# EAGLE design urbansensor (EAGLE 9.6.2)
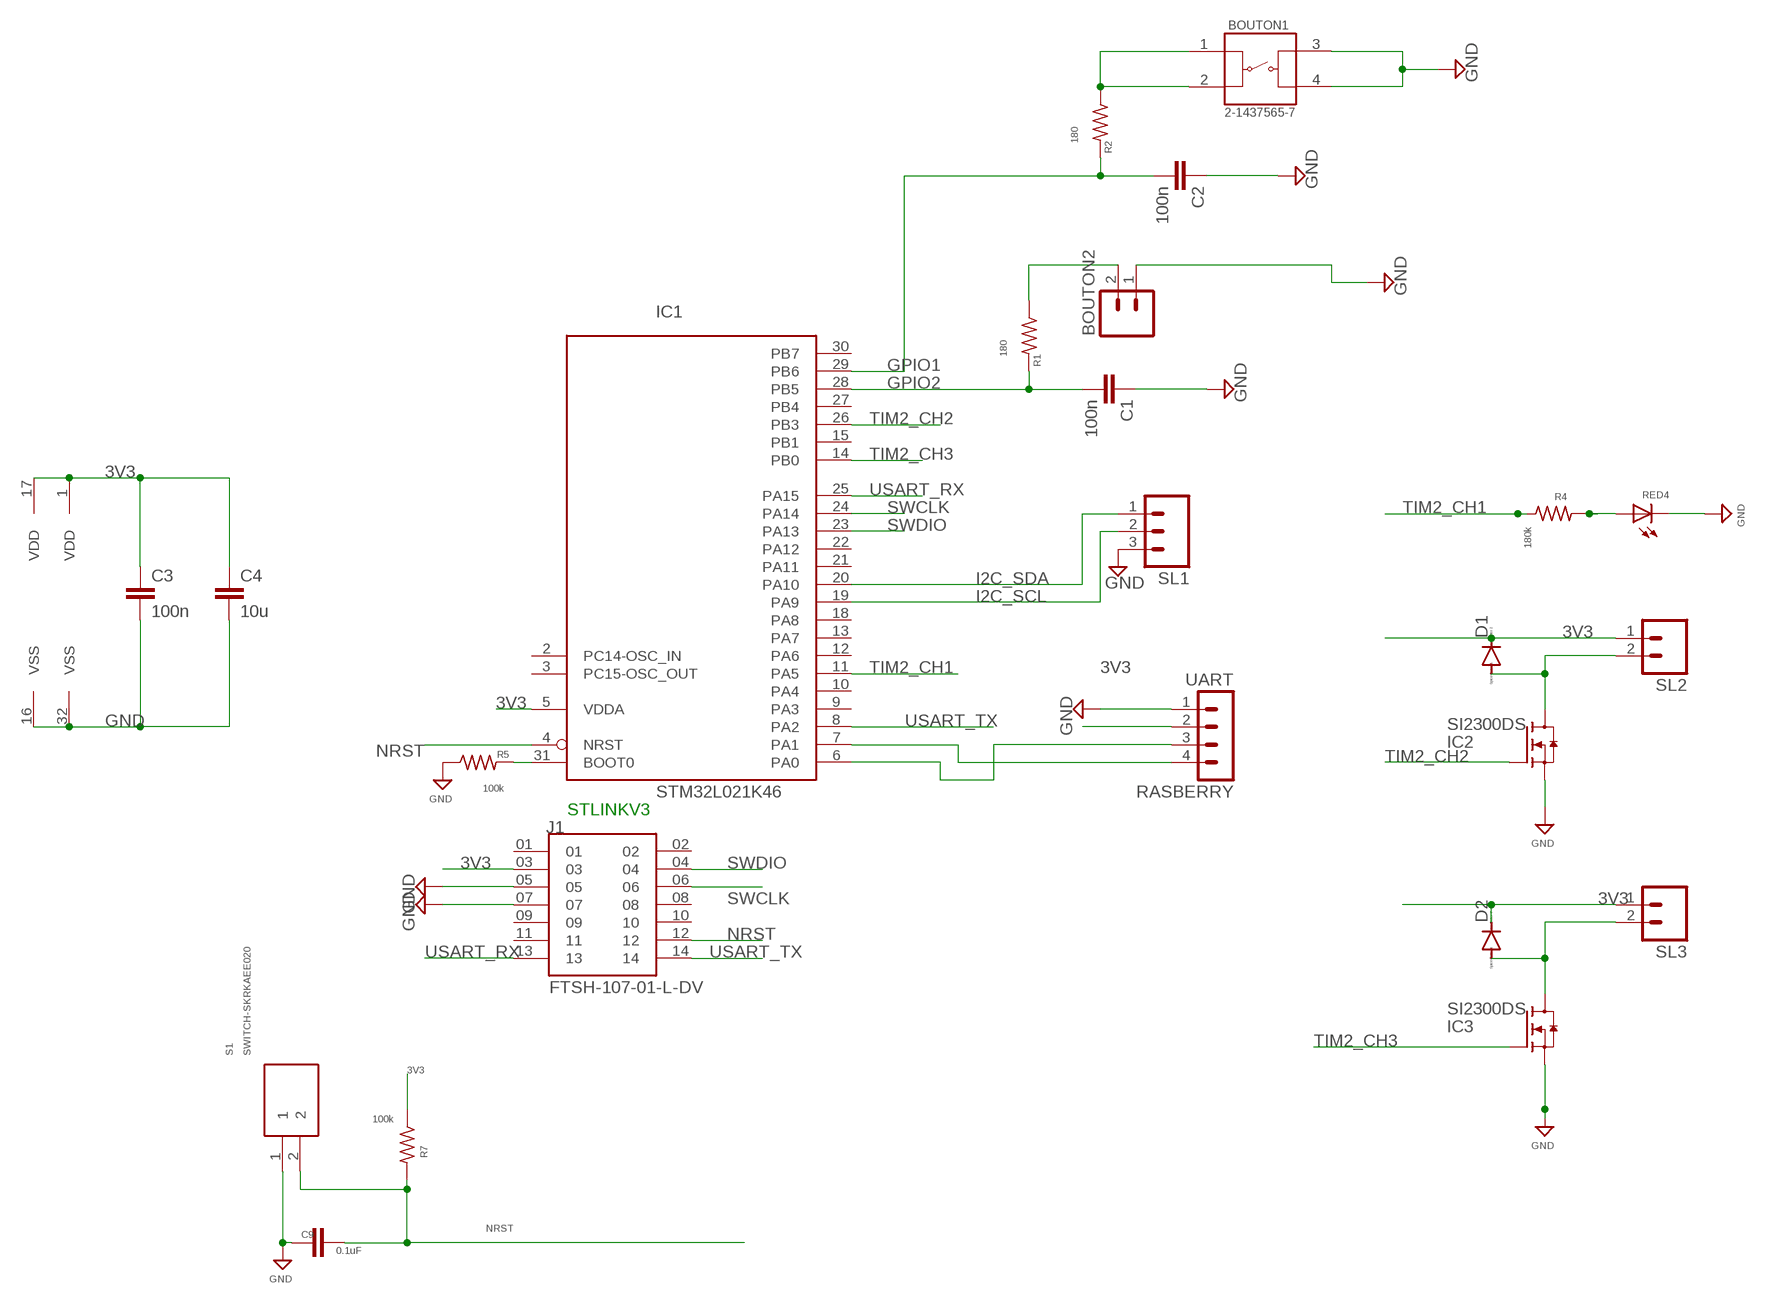
[diagram p0: schematic, sheet 1]

## Parts
BOUTON1  2-1437565-7  [SW_2-1437565-7]
BOUTON2  MA02  [02PA]
C1  100n  C-EUC0805  [C0805]
C2  100n  C-EUC0805  [C0805]
C3  100n  C-EUC0805  [C0805]
C4  10u  C-EUC1210  [C1210]
C9  0.1uF  PASSIF-CAP-1206  [1206]
D1  DIODE-SOD523  [SOD523]
D2  DIODE-SOD523  [SOD523]
IC1  STM32L021K46  [LQFP32]
IC2  SI2300DS  [SOT23]
IC3  SI2300DS  [SOT23]
J1  FTSH-107-01-L-DV  [SAMTEC_FTSH-107-01-L-DV]
R1  180  R-US0805  [R0805]
R2  180  R-US0805  [R0805]
R4  180k  R-US0805  [R0805]
R5  100k  R-US0805  [R0805]
R7  100k  R-US0805  [R0805]
RASBERRY  UART  MA04-1  [MA04-1]
RED4  LED-0603  [0603-LED]
S1  SWITCH-SKRKAEE020  [SKRKAEE020]
SL1  MA03  [03P]
SL2  MA02  [02PA]
SL3  MA02  [02PA]

## Nets
3V3: C3.1 C4.1 D1.C D2.C IC1.1(VDD) IC1.5(VDDA) IC1.17(VDD) J1.03 R7.1 RASBERRY.2 SL2.1 SL3.1
GND: BOUTON1.3 BOUTON1.4 BOUTON2.1 C1.1 C2.1 C3.2 C4.2 C9.1 IC1.16(VSS) IC1.32(VSS) IC2.2(S) IC3.2(S) J1.05 J1.07 R5.1 RASBERRY.1 RED4.C S1.1 SL1.3
GPIO1: C2.2 IC1.29(PB6) R2.2
GPIO2: C1.2 IC1.28(PB5) R1.2
I2C_SCL: IC1.19(PA9) SL1.2
I2C_SDA: IC1.20(PA10) SL1.1
LED_RD4: R4.2 RED4.A
N$1: IC1.7(PA1) RASBERRY.4
N$2: BOUTON2.2 R1.1
N$3: BOUTON1.1 BOUTON1.2 R2.1
N$4: D1.A IC2.3(D) SL2.2
N$5: IC1.31(BOOT0) R5.2
N$6: D2.A IC3.3(D) SL3.2
N$7: IC1.6(PA0) RASBERRY.3
NRST: C9.2 IC1.4(NRST) J1.12 R7.2 S1.2
SWCLK: IC1.24(PA14) J1.06
SWDIO: IC1.23(PA13) J1.04
TIM2_CH1: IC1.11(PA5) R4.1
TIM2_CH2: IC1.26(PB3) IC2.1(G)
TIM2_CH3: IC1.14(PB0) IC3.1(G)
USART_RX: IC1.25(PA15) J1.13
USART_TX: IC1.8(PA2) J1.14
Unconnected: IC1.2(PC14-OSC_IN) IC1.3(PC15-OSC_OUT) IC1.9(PA3) IC1.10(PA4) IC1.12(PA6) IC1.13(PA7) IC1.15(PB1) IC1.18(PA8) IC1.21(PA11) IC1.22(PA12) IC1.27(PB4) IC1.30(PB7) J1.01 J1.02 J1.08 J1.09 J1.10 J1.11

## Notes on the sheet
- STLINKV3

## Library data of the parts
BOUTON1 = 2-1437565-7:2-1437565-7: FSM2JSMA=SMT,TACTILE,PB SWITCH Check availability <https://pricing.snapeda.com/parts/FSM2JSMA/TE%20Connectivity/view-part?ref=eda>; AVAILABILITY: In Stock; COMMENT: 2-1437565-7; CONFIGURATION_POLE-THROW: Single Pole - Single Throw; CONTACT_CURRENT_RATING: 50 mA; DESCRIPTION: Tactile Switch SPST-NO Top Actuated Surface Mount; MF: TE Connectivity; MP: FSM2JSMA; PACKAGE: None; PRICE: None; PURCHASE-URL: https://pricing.snapeda.com/search/part/FSM2JSMA/?ref=eda
BOUTON2 SL2 SL3 = con-amp-quick:MA02: AMP QUICK CONNECTOR; OC_FARNELL: unknown; OC_NEWARK: unknown
C1-C4 = rcl:C-EU: CAPACITOR, European symbol; SPICEPREFIX: C
C9 = stock-perso:PASSIF-CAP
D1 D2 = diode:DIODE-: DIODE
IC1 = STM32_v3:STM32L021K4: ARM 32-bit Cortex™-M0+ CPU 32 MHz maximum frequency 32 to 64 Kbytes of Flash memory 2 kbyte of Data EEPROM 8 kbytes of SRAM 27 GPIOs 1.8 to 3.6 V application supply
IC2 IC3 = linear-eleves:SI2300DS: SOT-23 Single-Supply Centigrade Temperature Sensor Vout = (10mV/°C x Temp °C) +5mmmV Source: http://cache.national.com/ds/LM/LM50.pdf
J1 = FTSH-107-01-L-DV:FTSH-107-01-L-DV: Check availability <https://pricing.snapeda.com/parts/FTSH-107-01-L-DV/Samtec/view-part?ref=eda>; AVAILABILITY: In Stock; DESCRIPTION: Connector Header Surface Mount 14 position 0.050 (1.27mm); MF: Samtec; MP: FTSH-107-01-L-DV; PACKAGE: None; PRICE: None; PURCHASE-URL: https://pricing.snapeda.com/search/part/FTSH-107-01-L-DV/?ref=eda
R1 R2 R4 R5 R7 = MyComponents:R-US: SMD Resistor; MOUSER: 660-RK73H2ATTDD1R00F
RASBERRY = con-lstb:MA04-1: PIN HEADER; OC_FARNELL: unknown; OC_NEWARK: unknown
RED4 = Passives:LED
S1 = stock-perso:SWITCH-SKRKAEE020: Tactile Switches 3.9x2.9x2.0mm 160gf Packaging Temp 80oC Source: Datasheet <http://www.alps.com/prod/info/J/HTML/Tact/SurfaceMount/SKRK/SKRKAEE020.html>; DESCRIPTION: Tactile Switches 3.9x2.9x2.0mm 160gf Packaging Temp 80oC; HEIGHT: 2mm; MANUFACTURER_NAME: ALPS; MANUFACTURER_PART_NUMBER: SKRKAEE020; MOUSER_PART_NUMBER: 688-SKRKAEE020; MOUSER_PRICE-STOCK: https://www.mouser.co.uk/ProductDetail/ALPS/SKRKAEE020?qs=MrosSN5%252BUQW89XjXIp8Ugw%3D%3D
SL1 = con-amp-quick:MA03: AMP QUICK CONNECTOR; OC_FARNELL: unknown; OC_NEWARK: unknown

## Board
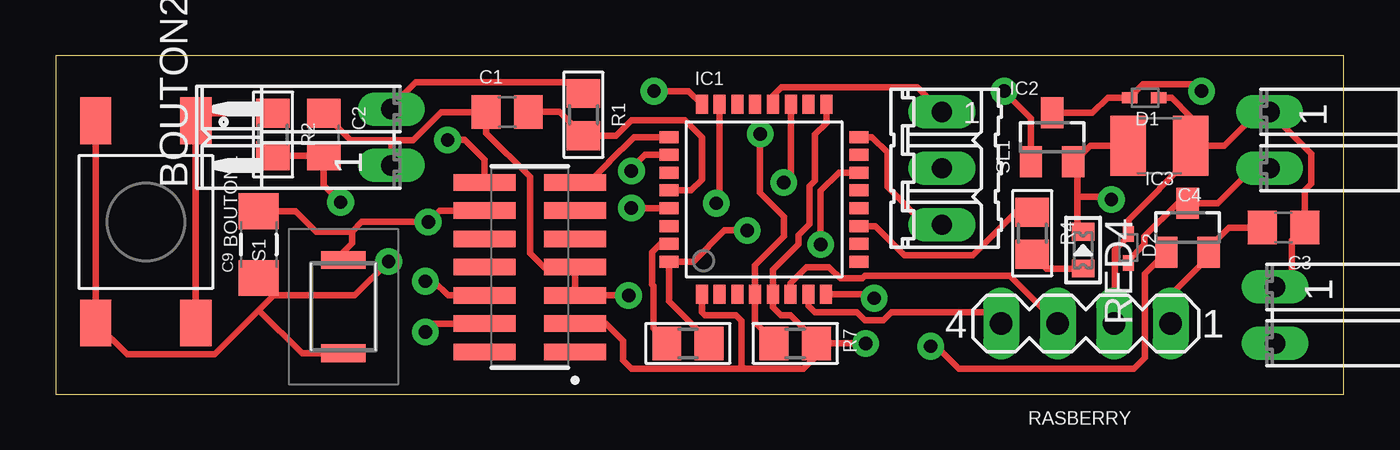
[diagram p1: board, top side]
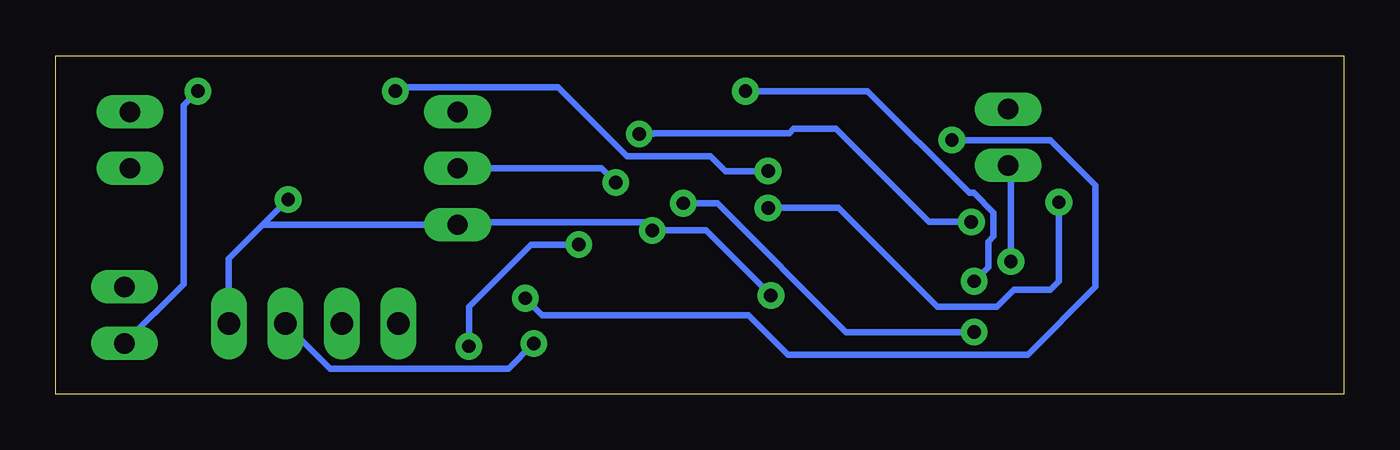
[diagram p2: board, bottom side, seen from below]

Size 57.96 x 15.23 mm. Coordinates in mm from the lower left corner, seen from the top.
Outline: 0,0 57.96,0 57.96,15.23 0,15.23 0,0
Copper layers (1*16): Top 0.035mm / dielectric 1.5mm / Bottom 0.035mm
Design rules "ENSEA_2021_design_exigeant *": minimum track width 0.3mm, minimum drill 0.6mm, track to track 0.2mm, track to pad 0.2mm, pad to pad 0.185mm, via to via 0.25mm, smd to smd 0.185mm, copper to edge 1mm, drill to drill 0.4mm, minimum pad ring 0.3mm, minimum via ring 0.3mm, stop-mask expansion 4mil, vias tented up to drill 0mil, thermal gap 0.4mm

### Footprints (pad centres in the part's own frame; a part is rotated, then mirrored left to right if it is on the bottom)
SW_2-1437565-7 = smd 2.1 x 1.4: 1 -4.55,2.25; 2 4.55,2.25; 3 -4.55,-2.25; 4 4.55,-2.25
02PA = drill 0.914 long: 1 -1.27,0; 2 1.27,0
C0805 = smd 1.3 x 1.5: 1 -0.95,0; 2 0.95,0
C1210 = smd 1.6 x 2.7: 1 -1.4,0; 2 1.4,0
1206 = smd 1.6 x 1.8: 1 -1.5,0; 2 1.5,0
SOD523 = smd 0.7 x 0.5: A 0.7,0; C -0.6,0
LQFP32 = smd 0.54 x 0.85: 1 -2.8,-4.275; 2 -2,-4.275; 3 -1.2,-4.275; 4 -0.4,-4.275; 5 0.4,-4.275; 6 1.19,-4.275; 7 1.99,-4.275; 8 2.79,-4.275; 17 2.8,4.275; 18 2,4.275; 19 1.2,4.275; 20 0.4,4.275; 21 -0.4,4.275; 22 -1.2,4.275; 23 -2,4.275; 24 -2.8,4.275 | smd 0.85 x 0.54: 9 4.275,-2.8; 10 4.275,-2; 11 4.275,-1.2; 12 4.275,-0.4; 13 4.275,0.4; 14 4.275,1.2; 15 4.275,2; 16 4.275,2.8; 25 -4.275,2.8; 26 -4.275,2; 27 -4.275,1.2; 28 -4.275,0.4; 29 -4.275,-0.4; 30 -4.275,-1.2; 31 -4.275,-2; 32 -4.275,-2.8
SOT23 = smd 1 x 1.4: 1 -0.95,-1.1; 2 0.95,-1.1; 3 0,1.1
SAMTEC_FTSH-107-01-L-DV = smd 0.74 x 2.79: 01 -3.81,-2.035; 02 -3.81,2.035; 03 -2.54,-2.035; 04 -2.54,2.035; 05 -1.27,-2.035; 06 -1.27,2.035; 07 0,-2.035; 08 0,2.035; 09 1.27,-2.035; 10 1.27,2.035; 11 2.54,-2.035; 12 2.54,2.035; 13 3.81,-2.035; 14 3.81,2.035
R0805 = smd 1.3 x 1.5: 1 -0.95,0; 2 0.95,0
MA04-1 = drill 1.016 long: 1 -3.81,0; 2 -1.27,0; 3 1.27,0; 4 3.81,0
0603-LED = smd 0.8 x 1: A 0.825,0; C -0.825,0
SKRKAEE020 = smd 0.8 x 2: 1 -2.1,0; 2 2.1,0
03P = drill 0.914 long: 1 -2.54,0; 2 0,0; 3 2.54,0

### Placement (x,y rotation side)
BOUTON1  4.06,7.75 270 top
BOUTON2  15.11,11.56 90 top
C1  20.32,12.7 0 top
C2  12.06,11.68 270 top
C3  55.24,7.49 180 top
C4  49.66,11.18 180 top
C9  9.14,6.73 90 top
D1  49.02,13.34 180 top
D2  48.26,6.6 270 top
IC1  31.88,8.76 0 top
IC2  44.83,11.56 0 top
IC3  50.93,7.49 0 top
J1  21.34,5.71 90 top
R1  23.75,12.57 270 top
R2  9.78,11.68 270 top
R4  43.94,7.24 270 top
R5  28.45,2.29 180 top
R7  33.27,2.29 180 top
RASBERRY  46.35,3.17 180 top
RED4  46.23,6.48 270 top
S1  12.95,3.94 90 top
SL1  39.88,10.16 270 top
SL2  54.86,3.56 270 top
SL3  54.61,11.43 270 top

### Tracks (layer width: path | path; a pad name or v marks a point on that pad's centre or on a via)
3V3  (via drill 0.6)
  Top 0.3: IC1.17 34.68,12.19 34.17,11.68 34.17,9.6 33.92,9.35 33.92,7.64 33.42,7.14 33.42,6.73 32.28,5.6 IC1.5 32.28,3.91 32.64,3.55 33.06,3.55 34.22,2.39 R7.1 34.29,2.29 | C4.1 52.58,11.18 54.11,12.7 SL3.1 56.49,10.82 56.49,9.46 56.2,9.17 C3.1 55.62,6.92 55.62,4.83 SL2.1 | D1.C 50.21,13.34 51.06,12.49 C4.1 | C4.1 51.06,10.63 48.26,7.83 D2.C 48.26,7.1 47.66,6.5 47.66,3.21 RASBERRY.2 | v36.45,2.29 34.29,2.29 | IC1.1 29.08,3.69 29.21,3.56 30.61,3.56 30.86,3.3 30.86,1.28 30.99,1.15 | 30.99,1.15 33.66,1.15 34.29,1.78 34.29,2.29 | 30.99,1.15 25.91,1.15 25.53,1.53 25.53,2.41 24.77,3.17 J1.03
  Bottom 0.3: RASBERRY.2 45.6,1.15 37.59,1.15 v36.45,2.29
GND  (via drill 0.6)
  Top 0.3: BOUTON1.3 BOUTON1.4 3.21,1.8 7.16,1.8 9.14,3.78 | R5.1 29.4,2.39 27.6,4.18 IC1.32 28.7,5.97 30.1,7.37 v31.11,7.37 | C2.1 13.27,11.43 15.11,11.43 | BOUTON2.1 15.11,11.43 | C4.2 46.55,11.18 45.84,10.46 IC2.2 45.78,10.13 45.97,9.94 45.97,8.89 | RASBERRY.1 50.16,4.48 51.88,6.19 IC3.2 51.88,6.59 52.78,7.49 C3.2 | 45.97,8.89 45.97,7.56 RED4.C | SL1.3 39.12,7.62 37.41,9.32 37.41,10.88 36.73,11.56 IC1.16 | 45.97,8.89 47.37,8.89 v47.5,8.76 | v14.99,5.97 13.46,4.45 9.93,4.45 | C9.1 9.93,4.45 | v25.78,4.45 J1.05 J1.07 21.97,5.71 21.34,6.35 21.34,9.78 19.37,11.75 C1.1 19.35,12.68 17.35,12.68 16.09,11.43 15.11,11.43 | 9.14,3.78 11.09,1.84 S1.1 | 9.93,4.45 9.81,4.45 9.14,3.78
  Bottom 0.3: v47.5,8.76 48.64,7.62 | 48.64,7.62 50.16,6.1 RASBERRY.1 | 48.64,7.62 SL1.3 39.77,7.73 31.48,7.73 v31.11,7.37 28.7,7.37 v25.78,4.45 | BOUTON2.1 14.99,10.16 v14.99,5.97
GPIO1  (via drill 0.6)
  Top 0.3: R2.2 C2.2 12.06,9.4 v12.83,8.64 | IC1.29 25.93,8.36 v25.91,8.38
  Bottom 0.3: v25.91,8.38 22.73,8.38 18.29,3.94 15.62,3.94 14.86,4.7 13.21,4.7 12.83,5.08 v12.83,8.64
GPIO2
  Top 0.3: C1.2 22.67,12.7 R1.2 25.21,11.62 25.91,12.32 28.32,12.32 29.08,11.56 29.08,9.65 28.59,9.16 IC1.28
I2C_SCL  (via drill 0.6)
  Top 0.3: IC1.19 33.08,9.84 v32.77,9.53
  Bottom 0.3: SL1.2 33.4,10.16 v32.77,9.53
I2C_SDA
  Top 0.3: SL1.1 38.77,13.81 32.66,13.81 32.28,13.43 IC1.20
LED_RD4
  Top 0.3: RED4.A 44.58,5.65 R4.2
N$1
  Top 0.3: RASBERRY.4 42.04,3.68 37.61,3.68 37.24,3.32 36.42,3.32 36.05,3.68 34.16,3.68 33.87,3.98 IC1.7
N$2
  Top 0.3: R1.1 23.24,14.03 16.19,14.03 15.11,12.95 BOUTON2.2
N$3
  Top 0.3: BOUTON1.2 BOUTON1.1 6.65,12.63 R2.1
N$4  (via drill 0.6)
  Top 0.3: IC2.3 46.66,12.66 47.33,13.34 D1.A 48.92,13.94 51.26,13.94 v51.56,13.63
  Bottom 0.3: v51.56,13.63 52.2,13 52.2,4.95 SL2.2
N$5
  Top 0.3: R5.2 27.5,2.39 26.91,2.98 26.91,4.86 26.83,4.94 26.83,6.38 27.21,6.76 IC1.31
N$6
  Top 0.3: SL3.2 53.85,10.16 52.29,8.59 IC3.3 50.48,8.59 48.99,7.1 48.99,6.74 48.26,6 D2.A
N$7
  Top 0.3: IC1.6 33.07,5 33.78,5.71 34.8,5.71 35.31,5.21 36.3,5.21 36.42,5.32 42.94,5.32 RASBERRY.3
NRST  (via drill 0.6)
  Top 0.3: J1.12 17.27,8.26 v16.76,7.75 13.78,7.75 13.34,7.31 | R7.2 32.32,2.39 31.48,3.23 IC1.4 31.48,5.81 32.77,7.1 32.77,7.98 31.7,9.05 v31.7,11.71 | C9.2 10.8,8.23 11.73,7.31 13.34,7.31 | S1.2 12.95,6.42 13.34,6.8 13.34,7.31
  Bottom 0.3: v31.7,11.71 31.06,11.71 31.02,11.75 24.96,11.75 24.77,11.94 22.86,11.94 18.67,7.75 v16.76,7.75
SWCLK  (via drill 0.6)
  Top 0.3: J1.06 17.65,4.45 17.02,5.08 v16.64,5.08 | v26.92,13.63 28.48,13.63 IC1.24
  Bottom 0.3: v16.64,5.08 16,5.71 16,6.86 15.76,7.1 15.76,8.16 16.66,9.05 16.86,9.05 21.43,13.63 v26.92,13.63
SWDIO  (via drill 0.6)
  Top 0.3: v16.64,2.79 17.02,3.17 J1.04 | v29.72,8.59 29.88,8.75 IC1.23
  Bottom 0.3: v29.72,8.59 28.19,8.59 22.4,2.79 v16.64,2.79
TIM2_CH1
  Top 0.3: R4.1 43.21,8.19 41.28,6.26 38.18,6.26 36.88,7.56 IC1.11
TIM2_CH2  (via drill 0.6)
  Top 0.3: IC1.26 26.51,10.76 25.91,10.16 v25.91,10.03 | v42.67,13.63 43.88,12.42 IC2.1
  Bottom 0.3: v42.67,13.63 42.42,13.88 42.41,13.88 42.49,13.81 35.36,13.81 32.26,10.71 28.49,10.71 27.81,10.03 v25.91,10.03
TIM2_CH3  (via drill 0.6)
  Top 0.3: IC3.1 49.01,5.42 49.01,1.64 48.51,1.15 40.63,1.15 39.62,2.16 v39.37,2.16 | v34.42,6.73 34.42,9.14 35.24,9.96 IC1.14
  Bottom 0.3: v39.37,2.16 39.37,3.94 36.58,6.73 v34.42,6.73
USART_RX
  Top 0.3: IC1.25 26.02,11.56 24.91,10.45 24.91,10.43 24.01,9.53 J1.13
USART_TX  (via drill 0.6)
  Top 0.3: IC1.8 36.66,4.49 v36.83,4.32 | v17.64,11.43 17.65,11.45 18.4,11.45 19.3,10.54 J1.14
  Bottom 0.3: v36.83,4.32 36.07,3.56 26.8,3.56 25.02,1.78 14.22,1.78 11.18,4.83 11.18,9.4 13.21,11.43 v17.64,11.43